# Altium schematic sheet DCDC.SchDoc
size A
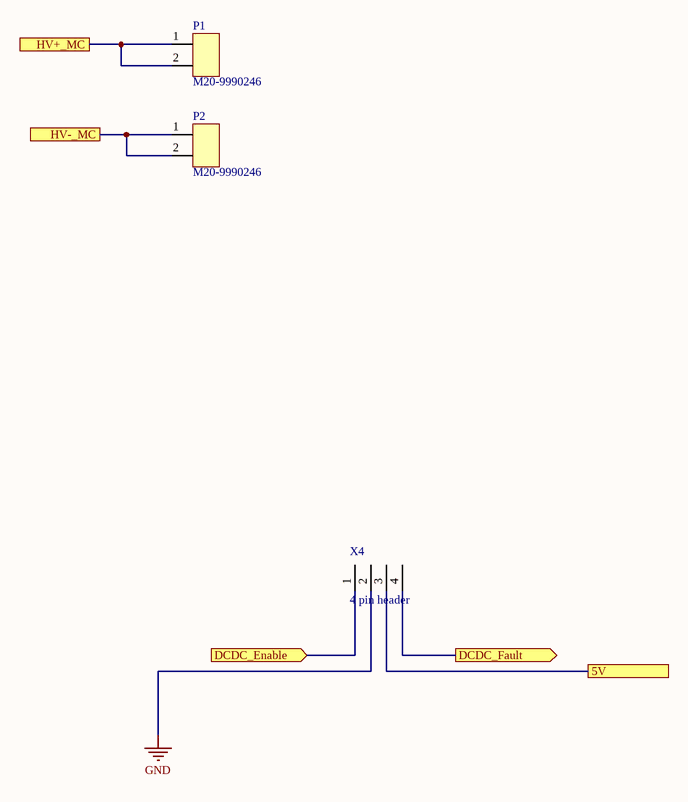
[diagram p0: DCDC.SchDoc]

## Parts
P1  M20-9990246  [M20-9990246]
P2  M20-9990246  [M20-9990246]
X4  4 pin header  [4pinheader]

## Ports
5V, DCDC_Enable (in), DCDC_Fault (out), HV+_MC, HV-_MC

## Nets
GND: X4.2
5V: X4.3 ; port 5V
DCDC_Enable: X4.1 ; port DCDC_Enable
DCDC_Fault: X4.4 ; port DCDC_Fault
HV+_MC: P1.1 P1.2 ; port HV+_MC
HV-_MC: P2.1 P2.2 ; port HV-_MC

## Library data of the parts
P1 P2 = 25: 2 Pin VCC Power Header, Male; Manufacturer_id: 1; idConn: 25; Value: CONN; Voltage_Rating: Null; Num_Contacts: 2; Pitch: 2.54; Created_By: Austin; Drawer_id: 1; Name: M20-9990246; Num_Rows: Null; Package: Conn; MfrPartNo: M20-9990246; Link: https://www.digikey.com/product-detail/en/harwin-inc/M20-9990246/952-2262-ND/3728226; ComponentLink1Description: Null; ComponentLink1URL: https://www.digikey.com/product-detail/en/harwin-inc/M20-9990246/952-2262-ND/3728226; Supplier1: Digi-Key; Supplier1PartNo: 952-2262-ND; Created_Date: 12/15/2018; Updated_By: Null
X4 = 40: id: 40; numcontacts: 4; numrows: 1; pitch: .1in; name: 4pinheader; quantity: 0; package: .1in